# EAGLE design ISP-FPC-RX-Adapter_2 (EAGLE 7.7.0)
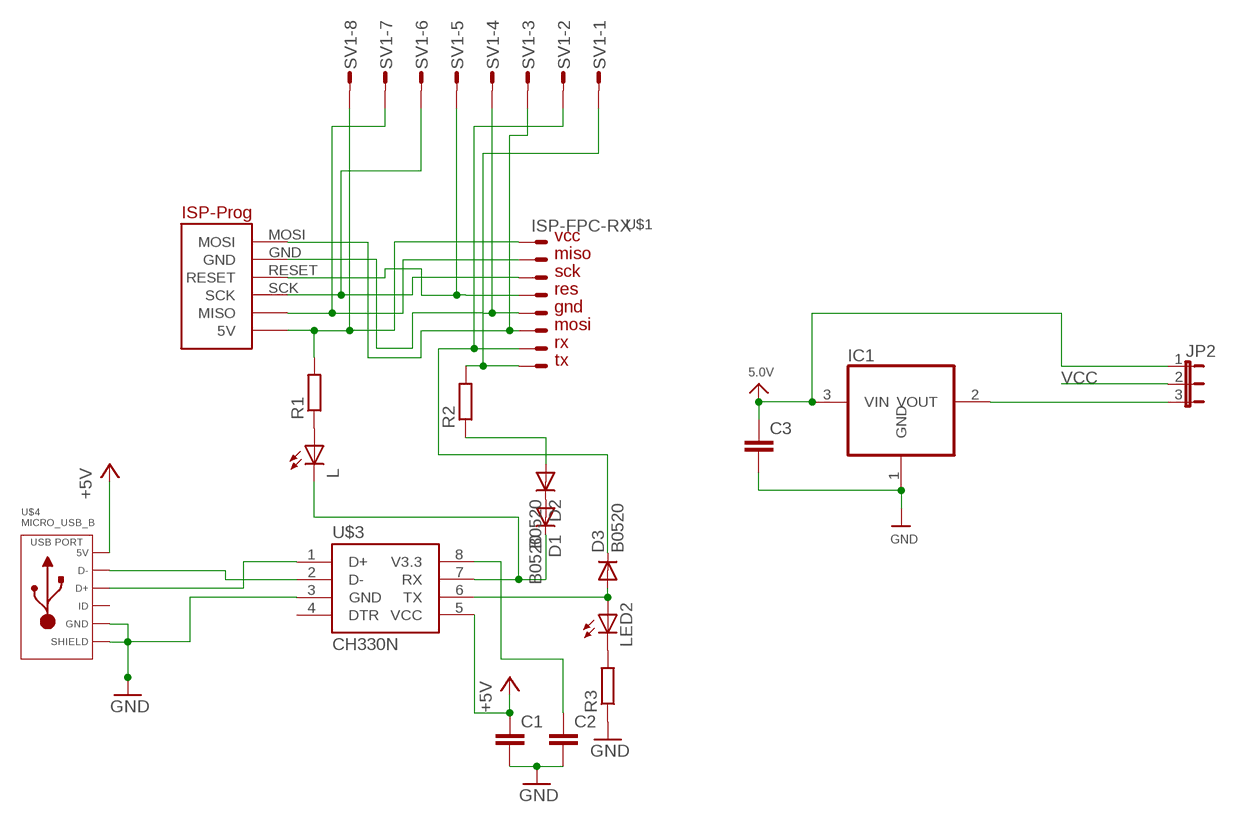
[diagram p0: schematic, sheet 1]

## Parts
C1  C-EUC0805  [C0805]
C2  C-EUC0805  [C0805]
C3  C-EUC1206  [C1206]
D1  B0520  DIODE-MELF-MLL41  [MELF-MLL41]
D2  B0520  DIODE-MELF-MLL41  [MELF-MLL41]
D3  B0520  DIODE-MELF-MLL41  [MELF-MLL41]
IC1  REG1117  [SOT223]
JP2  JP2E  [JP2]
L  LEDCHIP-LED0805  [CHIP-LED0805]
LED2  LEDCHIP-LED0805  [CHIP-LED0805]
R1  R-EU_R0805  [R0805]
R2  R-EU_R0805  [R0805]
R3  R-EU_R0805  [R0805]
SV1  S08P  [S08P]
U$1  ISP-FPC-RX  [ISP-FPC-RX]
U$2  ISP_PROG_STECKERISP_PROG_WANNENSTECKER  [ISP_PROG_WANNENSTECKER]
U$3  CH330N  [SOIC8]
U$4  MICRO_USB_B  [MICRO_USB_B]

## Nets
5.0V: C3.1 IC1.3(VIN) JP2.1
+5V: C1.1 U$3.5(VCC) U$4.1(5V)
GND: C1.2 C2.2 C3.2 IC1.1(GND) R3.1 SV1.4 U$1.GND U$2.GND U$3.3(GND) U$4.5(GND) U$4.S1(SLD) U$4.S2(SLD) U$4.S5(SLD) U$4.S6(SLD) U$4.S7(SLD) U$4.S8(SLD)
MISO: SV1.7 U$1.MISO U$2.MISO
MOSI: SV1.3 U$1.MOSI U$2.MOSI
N$7: U$3.2(D-) U$4.2(D-)
N$8: U$3.1(D+) U$4.3(D+)
N$9: D3.A LED2.A U$3.6(TX)
N$10: C2.1 U$3.8(V3.3)
N$11: IC1.2(VOUT) JP2.3
N$12: D1.C L.C U$3.7(RX)
N$14: L.A R1.1
N$15: D1.A D2.C
N$16: D2.A R2.1
N$18: LED2.C R3.2
RES: SV1.5 U$1.RES U$2.RESET
RX: D3.C SV1.2 U$1.RX
SCK: SV1.6 U$1.SCK U$2.SCK
TX: R2.2 SV1.1 U$1.TX
VCC: JP2.2 R1.2 SV1.8 U$1.VCC U$2.5V
Unconnected: U$4.4(ID)

## Power pins joined to a net without a drawn wire
DTR: U$3.4(DTR)

## Library data of the parts
C1-C3 = rcl:C-EU: CAPACITOR, European symbol
D1-D3 = diode:DIODE-: DIODE
IC1 = burr-brown:REG1117: 800mA and 1A Low Dropout (LDO) Positive Regulator 1.8V, 2.5V, 2.85V, 3.3V, 5V, and Adj; MPN: REG1117; OC_FARNELL: 1097566; OC_NEWARK: 14P6981
JP2 = jumper:JP2E: JUMPER
L LED2 = led:LED: LED OSRAM: - CHIPLED LG R971, LG N971, LY N971, LG Q971, LY Q971, LO R971, LY R971 LH N974, LH R974 LS Q976, LO Q976, LY Q976 LO Q996 - Hyper CHIPLED LW Q18S LB Q993, LB Q99A, LB R99A - SideLED LS A670, LO A670, LY A670, LG A670, LP A670 LB A673, LV A673, LT A673, LW A673 LH A674 LY A675 LS A676, LA A676, LO A676, LY A676, LW A676 LS A679, LY A679, LG A679 - Hyper Micro SIDELED® LS Y876, LA Y876, LO Y876, LY Y876 LT Y87S - SmartLED LW L88C, LW L88S LB L89C, LB L89S, LG L890 LS L89K, LO L89K, LY L89K LS L896, LA L896, LO L896, LY L896 - TOPLED LS T670, LO T670, LY T670, LG T670, LP T670 LSG T670, LSP T670, LSY T670, LOP T670, LYG T670 LG T671, LOG T671, LSG T671 LB T673, LV T673, LT T673, LW T673 LH T674 LS T676, LA T676, LO T676, LY T676, LB T676, LH T676, LSB T676, LW T676 LB T67C, LV T67C, LT T67C, LS T67K, LO T67K, LY T67K, LW E67C LS E67B, LA E67B, LO E67B, LY E67B, LB E67C, LV E67C, LT E67C LW T67C LS T679, LY T679, LG T679 LS T770, LO T770, LY T770, LG T770, LP T770 LB T773, LV T773, LT T773, LW T773 LH T774 LS E675, LA E675, LY E675, LS T675 LS T776, LA T776, LO T776, LY T776, LB T776 LHGB T686 LT T68C, LB T68C - Hyper Mini TOPLED® LB M676 - Mini TOPLED Santana® LG M470 LS M47K, LO M47K, LY M47K Source: http://www.osram.convergy.de LUXEON: - LUMILED® LXK2-PW12-R00, LXK2-PW12-S00, LXK2-PW14-U00, LXK2-PW14-V00 LXK2-PM12-R00, LXK2-PM12-S00, LXK2-PM14-U00 LXK2-PE12-Q00, LXK2-PE12-R00, LXK2-PE12-S00, LXK2-PE14-T00, LXK2-PE14-U00 LXK2-PB12-K00, LXK2-PB12-L00, LXK2-PB12-M00, LXK2-PB14-N00, LXK2-PB14-P00, LXK2-PB14-Q00 LXK2-PR12-L00, LXK2-PR12-M00, LXK2-PR14-Q00, LXK2-PR14-R00 LXK2-PD12-Q00, LXK2-PD12-R00, LXK2-PD12-S00 LXK2-PH12-R00, LXK2-PH12-S00 LXK2-PL12-P00, LXK2-PL12-Q00, LXK2-PL12-R00 Source: www.luxeon.com KINGBRIGHT: KA-3528ASYC Source: www.kingbright.com
R1-R3 = rcl:R-EU_: RESISTOR, European symbol
SV1 = con-amp-mt:S08P: AMP MT CONNECTOR; OC_FARNELL: unknown; OC_NEWARK: unknown
U$1 = LW_DUB:ISP-FPC-RX
U$2 = LW_DUB:ISP_PROG_STECKER
U$3 = ch330n:CH330N
U$4 = LW_DUB:MICRO_USB_B

## Board
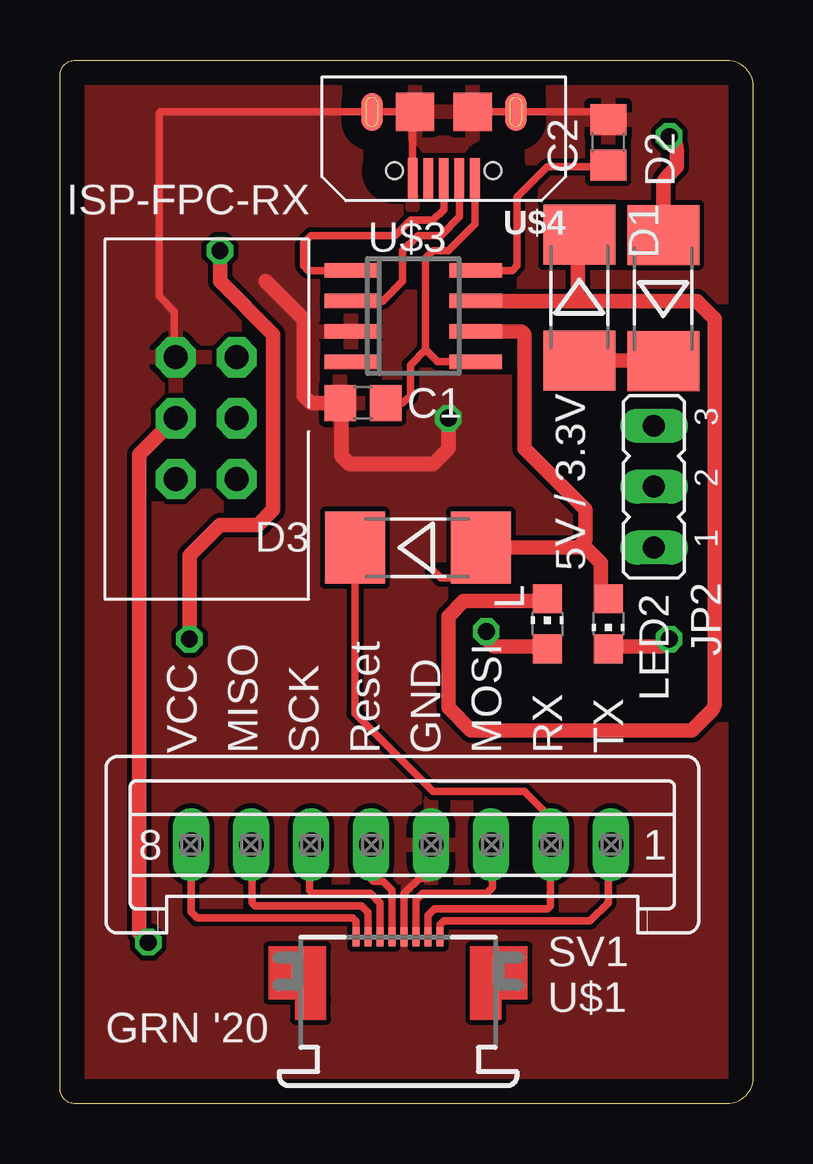
[diagram p1: board, top side]
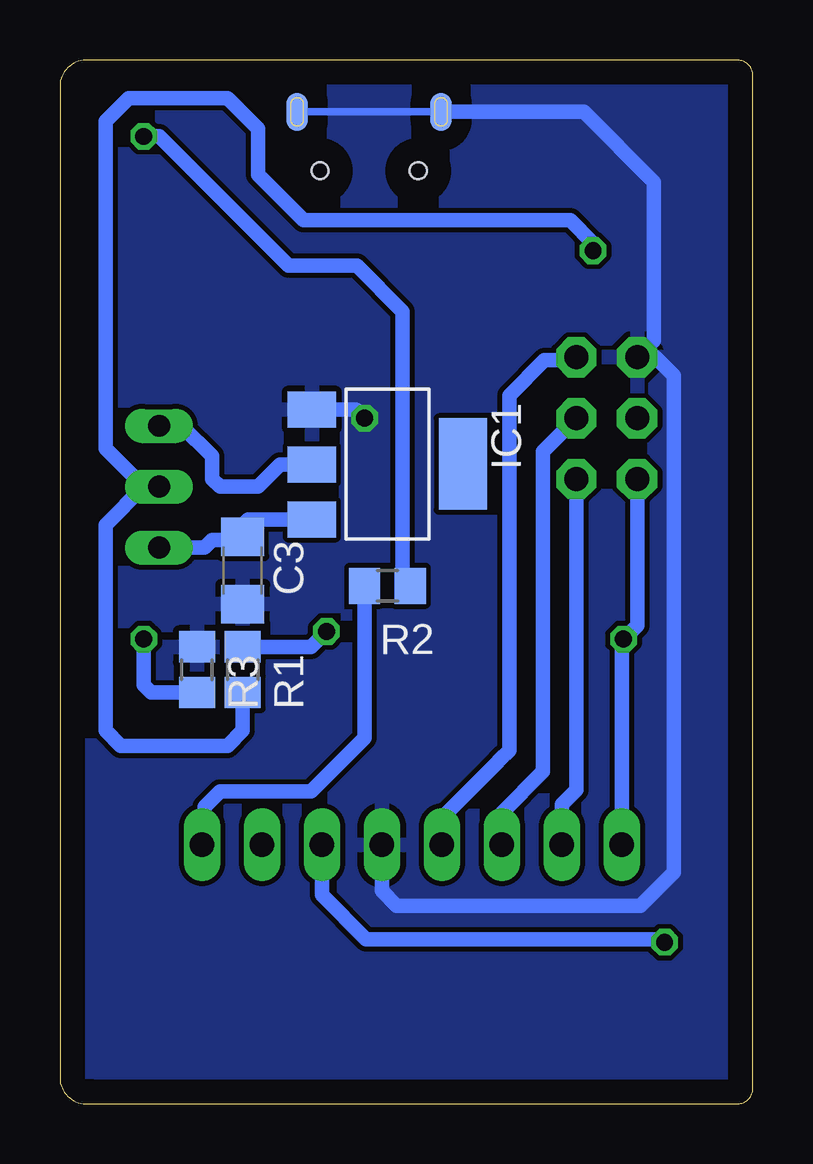
[diagram p2: board, bottom side, seen from below]

Size 28.89 x 43.52 mm. Coordinates in mm from the lower left corner, seen from the top.
Outline: 27.62,0.01 0.64,0.01 arc-90 0,0.65 0,42.87 arc-90 0.64,43.51 27.62,43.51 arc-90 28.89,42.56 28.89,0.96 arc-90 27.62,0.01
Copper layers (1*16): Top 0.035mm / dielectric 1.5mm / Bottom 0.035mm
Design rules "default": minimum track width 10mil, minimum drill 24mil, track to track 8mil, track to pad 8mil, pad to pad 8mil, via to via 8mil, smd to smd 8mil, copper to edge 40mil, drill to drill 8mil, minimum pad ring 10mil, minimum via ring 8mil, stop-mask expansion 4mil, vias tented up to drill 0mil, thermal gap 10mil

### Footprints (pad centres in the part's own frame; a part is rotated, then mirrored left to right if it is on the bottom)
C0805 = smd 1.3 x 1.5: 1 -0.95,0; 2 0.95,0
C1206 = smd 1.6 x 1.8: 1 -1.4,0; 2 1.4,0
MELF-MLL41 = smd 2.5 x 3: A 2.625,0; C -2.625,0
SOT223 = smd 1.499 x 2.007: 1 -2.261,-3.15; 2 0.025,-3.15; 3 2.311,-3.15 | smd 3.81 x 2.007: 4 0,3.15
JP2 = drill 0.914 long: 1 -2.54,0; 2 0,0; 3 2.54,0
CHIP-LED0805 = smd 1.2 x 1.2: A 0,-1.05; C 0,1.05
R0805 = smd 1.3 x 1.5: 1 -0.95,0; 2 0.95,0
S08P = drill 1.016 long: 1 8.75,0; 2 6.25,0; 3 3.75,0; 4 1.25,0; 5 -1.25,0; 6 -3.75,0; 7 -6.25,0; 8 -8.75,0
ISP-FPC-RX = smd 0.3 x 0.8: GND 0.25,1.87; MISO -1.25,1.87; MOSI 0.75,1.87; RES -0.25,1.87; RX 1.25,1.87; SCK -0.75,1.87; TX 1.75,1.87; VCC -1.75,1.87
ISP_PROG_WANNENSTECKER = drill 1 pad 1.676 octagon: 5V 2.54,-1.27; GND -2.54,-1.27; MISO 2.54,1.27; MOSI 0,-1.27; RESET -2.54,1.27; SCK 0,1.27
SOIC8 = smd 0.6 x 2.2: 1 -1.905,-2.6; 2 -0.635,-2.6; 3 0.635,-2.6; 4 1.905,-2.6; 5 1.905,2.6; 6 0.635,2.6; 7 -0.635,2.6; 8 -1.905,2.6
MICRO_USB_B = smd 0.4 x 1.7: 1 -1.3,1.37; 2 -0.65,1.37; 3 0,1.37; 4 0.65,1.37; 5 1.3,1.37 | smd 0.9 x 1.6: S1 -3,-1.4; S2 3,-1.4 | smd 1.6 x 1.6: S5 -1.2,-1.405; S6 1.2,-1.405 | smd 0.9 x 1.6 bottom: S7 -3,-1.4; S8 3,-1.4 | hole 0.7: -2.05,1.05; 2.05,1.05

### Placement (x,y rotation side)
C1  12.64,29.22 180 top
C2  22.86,40.08 90 top
C3  21.27,22.24 270 bottom
D1  21.65,33.6 270 top
D2  25.15,33.6 90 top
D3  14.92,23.19 0 top
IC1  15.24,26.68 270 bottom
JP2  24.76,25.73 90 top
L  20.32,20.01 0 top
LED2  22.86,20.01 180 top
R1  21.27,18.11 270 bottom
R2  15.24,21.6 180 bottom
R3  23.18,18.11 270 bottom
SV1  14.22,10.81 0 top
U$1  14.1,5.09 0 top
U$2  6.1,28.59 270 top
U$3  14.73,32.84 270 top
U$4  16,39.95 180 top

### Tracks (layer width: path | path; a pad name or v marks a point on that pad's centre or on a via)
5.0V
  Bottom 0.61: IC1.3 21.04,24.37 21.27,24.14 C3.1 21.4,23.51 22.54,23.51 22.86,23.19 JP2.1
+5V
  Top 0.305: U$4.1 17.3,36.68 16.19,35.57 15.56,35.57 15.24,35.25 15.24,31.44 | 15.24,31.44 15.75,30.94 U$3.5 | 15.24,31.44 14.61,30.81 14.61,29.54 14.29,29.22 C1.1
GND  (via drill 0.7)
  Top 0.305: U$1.GND 14.35,8.77 14.99,9.41 15.37,9.41 15.49,9.54 15.49,10.79 SV1.4 | U$4.S5 U$4.S7 22.54,41.35 C2.2 | U$4.5 14.7,41.26 U$4.S6 U$4.S8 4.19,41.35 4.13,41.29 4.13,33.67 4.76,33.03 4.76,31.13
  Top 0.61: 8.57,34.3 10.16,32.71 10.16,29.54 10.48,29.22 C1.2 11.75,29.16 11.75,27 12.06,26.68 15.56,26.68 16.19,27.32 v16.19,28.59
  Bottom 0.305: U$4.S8 U$4.S6 U$4.S7
  Bottom 0.61: SV1.4 15.47,8.88 14.86,8.27 4.7,8.27 3.3,9.66 3.3,30.36 4.06,31.13 U$2.GND 4.13,31.82 4.13,38.43 7.05,41.35 U$4.S8 | IC1.1 16.55,28.94 v16.19,28.59
  pour Bottom: 0,-2.02 29.02,-1.39 29.02,44.4 -0.63,44.08
  pour Top: -0.57,43.7 -0.25,-2.28 29.27,-1.64 29.59,44.33
MISO
  Top 0.305: U$1.MISO 12.85,7.99 12.57,8.27 8.13,8.27 8,8.39 8,10.78 SV1.7
  Bottom 0.61: SV1.7 7.97,12.48 7.37,13.09 U$2.MISO
MOSI  (via drill 0.7)
  Top 0.305: U$1.MOSI 14.85,8.51 15.11,8.77 17.78,8.77 18.03,9.03 18.03,10.75 SV1.3
  Top 0.61: U$2.MOSI 3.3,27.06 3.3,7.12 v3.68,6.74
  Bottom 0.61: SV1.3 17.97,8.71 16.13,6.87 3.81,6.87 v3.68,6.74
N$7
  Top 0.305: U$4.2 16.65,36.98 15.88,36.21 14.92,36.21 14.29,35.57 14.29,34.3 13.46,33.47 U$3.2
N$8
  Top 0.305: U$3.1 10.35,34.75 10.16,34.94 10.16,35.89 10.48,36.21 13.97,36.21 14.61,36.84 15.56,36.84 16,37.29 U$4.3
N$9
  Top 0.305: 15.56,22.24 15.88,21.92 17.23,21.92 D3.A
  Top 0.61: 21.59,23.19 D3.A 17.14,23.59 | 21.59,23.19 21.91,23.19 22.54,22.55 22.54,21.38 LED2.A | U$3.6 19.24,32.21 19.37,32.08 19.37,27.32 21.91,24.78 21.91,23.51 21.59,23.19
N$10
  Top 0.305: U$3.8 18.86,34.75 19.05,34.94 19.05,37.79 20.32,39.06 22.79,39.06 C2.1
N$11
  Bottom 0.61: IC1.2 19.71,26.66 20.64,25.73 22.22,25.73 22.54,26.05 22.54,27 23.81,28.27 JP2.3
N$12
  Top 0.305: 21.91,35.97 D1.C
  Top 0.61: U$3.7 21.4,33.47 | 21.4,33.47 21.59,33.67 21.59,36.16 D1.C | 21.4,33.47 26.54,33.47 27.3,32.71 27.3,16.78 arc-45 27.12,16.33 26.35,15.57 17.14,15.57 16.19,16.52 16.19,20.33 16.83,20.97 20.22,20.97 L.C
N$14  (via drill 0.7)
  Top 0.61: v17.78,19.7 17.78,19.38 18.1,19.06 20.22,19.06 L.A
  Bottom 0.61: R1.1 18.42,19.06 v17.78,19.7
N$15
  Top 0.61: D1.A 24.83,30.98 D2.C
N$16  (via drill 0.7)
  Top 0.61: D2.A 25.15,38.23 arc-45 25.33,38.68 25.72,39.06 25.72,39.75 arc45 25.53,40.2 v25.4,40.33
  Bottom 0.61: v25.4,40.33 24.76,40.33 19.37,34.94 16.51,34.94 14.61,33.03 14.61,21.92 R2.1
N$18  (via drill 0.7)
  Top 0.61: v25.4,19.38 25.08,19.06 22.96,19.06 LED2.C
  Bottom 0.61: R3.2 25.08,17.16 25.4,17.47 v25.4,19.38
RES
  Top 0.305: U$1.RES 13.85,8.9 13.46,9.28 13.08,9.28 12.95,9.41 12.95,10.79 SV1.5
  Bottom 0.61: SV1.5 12.97,11.93 10.7,14.2 10.54,14.36 10.16,14.74 10.16,29.54 8.7,31 7.49,31 U$2.RESET
RX
  Top 0.305: U$1.RX 15.35,7.86 15.62,8.14 20.32,8.14 20.45,8.27 20.45,10.78 SV1.2 20.32,10.96 20.32,12.08 19.37,13.03 15.56,13.03 12.3,16.29 D3.C
SCK
  Top 0.305: U$1.SCK 13.35,8.38 12.95,8.77 10.54,8.77 10.41,8.9 10.41,10.75 SV1.6
  Bottom 0.61: SV1.6 10.47,12.14 8.76,13.85 8.76,27.19 U$2.SCK
TX
  Top 0.305: U$1.TX 15.85,7.48 16,7.63 22.1,7.63 22.86,8.39 22.86,10.69 SV1.1
  Top 0.61: 22.99,10.82 SV1.1 22.9,10.88
  Bottom 0.61: R2.2 16.19,15.25 18.41,13.03 22.22,13.03 22.86,12.39 22.86,10.92 SV1.1
VCC  (via drill 0.7)
  Top 0.305: U$1.VCC 12.35,7.6 12.19,7.76 5.72,7.76 5.46,8.01 5.46,10.79 SV1.8
  Top 0.61: v5.4,19.38 5.4,22.87 6.67,24.14 8.25,24.14 8.89,24.78 8.89,32.08 6.67,34.3 v6.67,35.57
  Bottom 0.61: SV1.8 5.47,19.3 v5.4,19.38 4.83,19.95 U$2.5V | v6.67,35.57 6.67,35.89 7.62,36.84 18.73,36.84 20.64,38.75 20.64,40.65 21.91,41.92 26.04,41.92 26.99,40.97 26.99,27.32 25.4,25.73 | 25.4,25.73 JP2.2 | R1.2 21.27,15.57 21.91,14.93 26.35,14.93 26.99,15.57 26.99,24.14 25.4,25.73

### Text on the board
tNames: ISP-FPC-RX | 5V / 3.3V | VCC | MISO | SCK | Reset | GND | MOSI | RX | TX | GRN '20